# EAGLE design v2_hackspace (EAGLE 9.6.2)
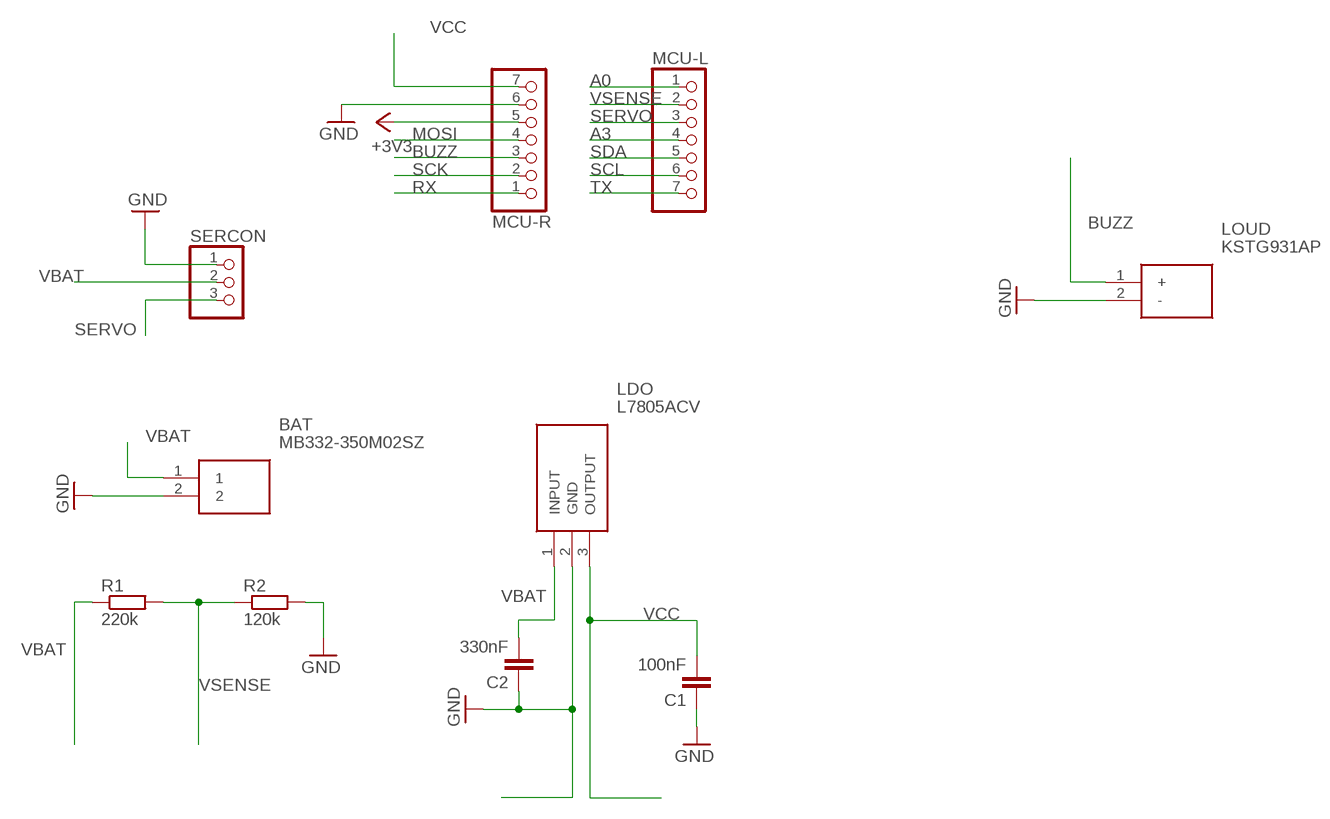
[diagram p0: schematic, sheet 1]

## Parts
BAT  MB332-350M02SZ  [MB332350M02SZ]
C1  100nF  C-EU025-024X044  [C025-024X044]
C2  330nF  C-EU025-024X044  [C025-024X044]
LDO  L7805ACV  [TO255P460X1020X2008-3P]
LOUD  KSTG931AP  [CAPPRD400W70D900H500]
MCU-L  HEADER-1X7  [1X07_OVAL]
MCU-R  HEADER-1X7  [1X07_OVAL]
R1  220k  R-EU_0204/2V  [0204V]
R2  120k  R-EU_0204/2V  [0204V]
SERCON  PINHD-1X3  [1X03]

## Nets
+3V3: MCU-R.5
A0: MCU-L.1
A3: MCU-L.4
BUZZ: LOUD.1(+) MCU-R.3
GND [power]: BAT.2 C1.1 C2.1 LDO.2(GND) LOUD.2(-) MCU-R.6 R2.2 SERCON.1
MOSI: MCU-R.4
RX: MCU-R.1
SCK: MCU-R.2
SCL: MCU-L.6
SDA: MCU-L.5
SERVO: MCU-L.3 SERCON.3
TX: MCU-L.7
VBAT: BAT.1 C2.2 LDO.1(INPUT) R1.1 SERCON.2
VCC [power]: C1.2 LDO.3(OUTPUT) MCU-R.7
VSENSE: MCU-L.2 R1.2 R2.1

## Library data of the parts
BAT = SamacSys_Parts:MB332-350M02SZ: RS PRO 3.5mm Pitch Straight, PCB Terminal Block, Through Hole, 2 Way Source: Datasheet; DESCRIPTION: RS PRO 3.5mm Pitch Straight, PCB Terminal Block, Through Hole, 2 Way; HEIGHT: 12.76mm; MANUFACTURER_NAME: RS Components; MANUFACTURER_PART_NUMBER: MB332-350M02SZ; RS_PART_NUMBER: 7901149; RS_PRICE-STOCK: https://uk.rs-online.com/web/p/products/7901149
C1 C2 = rcl:C-EU: CAPACITOR, European symbol; SPICEPREFIX: C
LDO = SamacSys_Parts:L7805ACV: Linear voltage regulator,L7805ACV 5V 1A STMicroelectronics L7805ACV, Single Linear Voltage Regulator, 1A 5 V, 2%, 3-Pin TO-220 Source: Datasheet <http://uk.rs-online.com/web/p/products/2988508P>; ALLIED_NUMBER: 70013701; DESCRIPTION: Linear voltage regulator,L7805ACV 5V 1A STMicroelectronics L7805ACV, Single Linear Voltage Regulator, 1A 5 V, 2%, 3-Pin TO-220; HEIGHT: 4.6mm; MANUFACTURER_NAME: STMicroelectronics; MANUFACTURER_PART_NUMBER: L7805ACV; RS_PART_NUMBER: 2988508P; RS_PRICE-STOCK: http://uk.rs-online.com/web/p/products/2988508P
LOUD = SamacSys_Parts:KSTG931AP: RS PRO 4V Electromagnetic Buzzer, 92dB Source: Datasheet; DESCRIPTION: RS PRO 4V Electromagnetic Buzzer, 92dB; HEIGHT: 5mm; MANUFACTURER_NAME: RS Components; MANUFACTURER_PART_NUMBER: KSTG931AP
MCU-L MCU-R = microbuilder:HEADER-1X7: PIN HEADER
R1 R2 = rcl:R-EU_: RESISTOR, European symbol; SPICEPREFIX: R
SERCON = pinhead:PINHD-1X3: PIN HEADER

## Net classes
1 power: width 0.305 mm

## Board
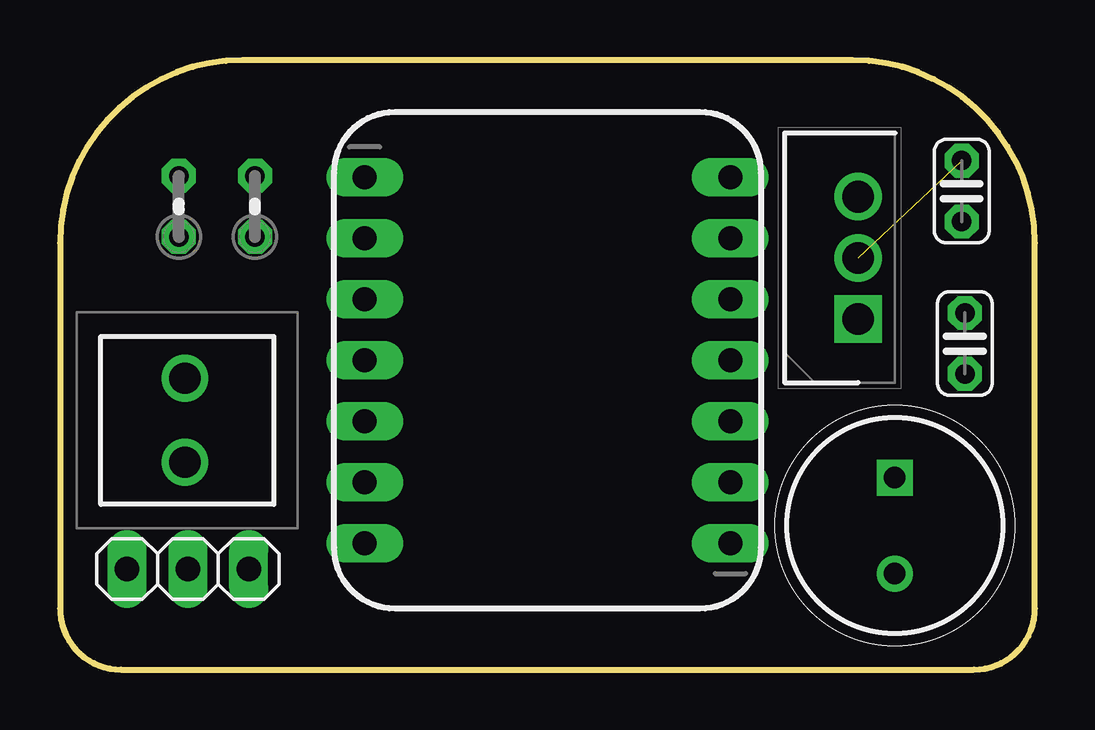
[diagram p1: board, top side]
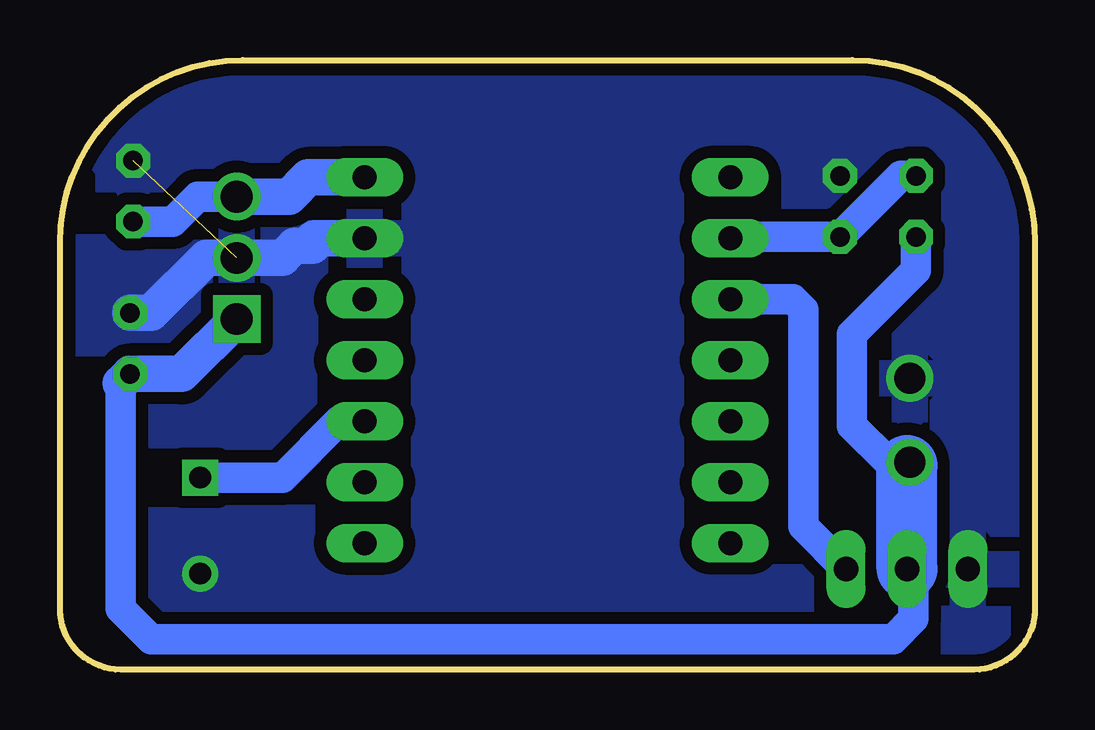
[diagram p2: board, bottom side, seen from below]

Size 40.64 x 25.4 mm. Coordinates in mm from the lower left corner, seen from the top.
Outline: 7.62,25.4 arc90 0,17.78 0,2.54 arc90 2.54,0 38.1,0 arc90 40.64,2.54 40.64,17.78 arc90 33.02,25.4 7.62,25.4
Copper layers (1*16): Top 0.035mm / dielectric 1.5mm / Bottom 0.035mm
Design rules "aisler_2_layer_simple *": minimum track width 0.1mm, minimum drill 0.3mm, track to track 0.1mm, track to pad 0.1mm, pad to pad 0.1mm, via to via 0.1mm, smd to smd 0.1mm, copper to edge 0.3mm, drill to drill 0.25mm, minimum pad ring 0.3mm, minimum via ring 0.2mm, stop-mask expansion 0mil, vias tented up to drill 0mil, thermal gap 10mil

### Footprints (pad centres in the part's own frame; a part is rotated, then mirrored left to right if it is on the bottom)
MB332350M02SZ = drill 1.3 pad 1.95: 1 0,0; 2 3.5,0
C025-024X044 = drill 0.813 octagon: 1 -1.27,0; 2 1.27,0
TO255P460X1020X2008-3P = drill 1.32 pad 1.98 square: 1 0,0 | drill 1.32 pad 1.98: 2 2.55,0; 3 5.1,0
CAPPRD400W70D900H500 = drill 0.9 pad 1.35 square: 1 0,0 | drill 0.9 pad 1.35: 2 4,0
1X07_OVAL = drill 1 long: 1 -7.62,0; 2 -5.08,0; 3 -2.54,0; 4 0,0; 5 2.54,0; 6 5.08,0; 7 7.62,0
0204V = drill 0.813 octagon: 1 -1.27,0; 2 1.27,0
1X03 = drill 1.016 long: 1 -2.54,0; 2 0,0; 3 2.54,0

### Placement (x,y rotation side)
BAT  5.21,8.64 90 top
C1  37.59,19.94 270 top
C2  37.72,13.59 270 top
LDO  33.27,14.61 90 top
LOUD  34.8,8 270 top
MCU-L  12.7,12.89 270 top
MCU-R  27.94,12.89 90 top
R1  4.95,19.3 90 top
R2  8.13,19.3 90 top
SERCON  5.33,4.19 0 top

### Tracks (layer width: path | path; a pad name or v marks a point on that pad's centre or on a via)
BUZZ
  Bottom 1.27: MCU-R.3 29.02,10.35 31.37,8 LOUD.1
GND  (1 unrouted)
  Bottom 1.524: C2.1 36.83,14.86 34.53,17.16 LDO.2 31.36,17.16 30.86,17.65 30.1,17.65 30.1,17.91 30.04,17.97 MCU-R.6
  pour Bottom (isolate 0.508): 0,-2.54 40.64,-2.54 43.18,0 43.18,25.4 40.64,27.94 0,27.94 -2.54,25.4 -2.54,0
SERVO
  Bottom 1.27: SERCON.3 9.65,5.97 9.65,14.99 10.1,15.43 MCU-L.3
VBAT
  Bottom 1.27: SERCON.2 5.06,3.92 5.06,2.11 5.9,1.27 36.83,1.27 38.1,2.54 38.1,11.94 | BAT.1 6.1,8.64 7.62,10.16 7.62,13.97 4.95,16.64 R1.1
  Bottom 1.524: LDO.1 35.56,12.32 C2.2 38.1,11.94
  Bottom 2.032: 5.33,8.51 BAT.1
  Bottom 2.54: SERCON.2 5.33,8.51
VCC
  Bottom 1.27: LDO.3 34.91,19.7 35.94,18.67 C1.2
  Bottom 1.524: MCU-R.7 30.29,20.51 31.09,19.7 LDO.3
VSENSE
  Bottom 1.27: MCU-L.2 12.64,18.03 R2.1 5.59,20.57 R1.2